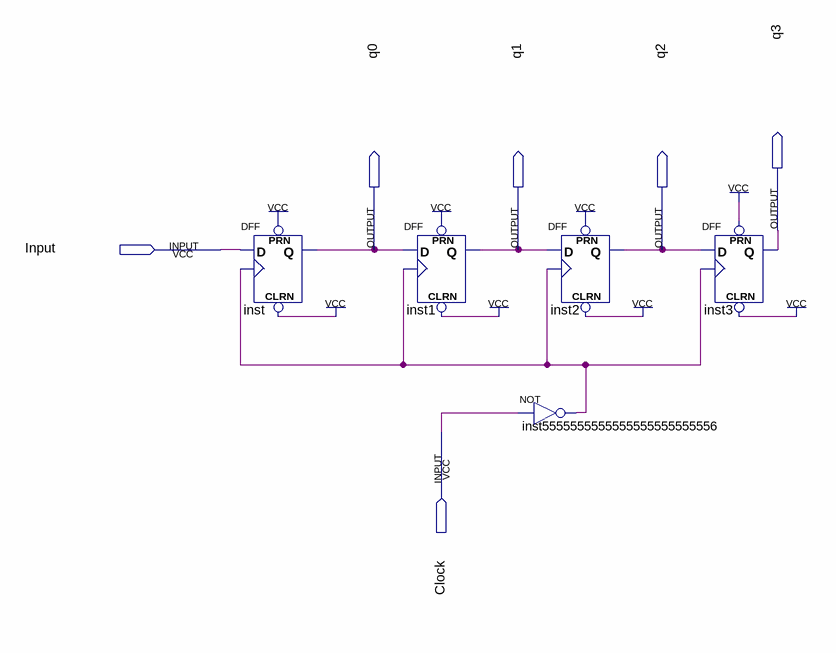
[diagram p0: schematic sheet]
// Quartus schematic lab10step1.bdf as structural Verilog: 5 symbols, 6 pins
module lab10step1 (
  input  Input,
  input  Clock,
  output q3,
  output q0,
  output q1,
  output q2
);

  wire inst5555555555555555555555556_out;

  DFF inst (.CLRN(1'b1), .CLK(inst5555555555555555555555556_out), .D(Input), .PRN(1'b1), .Q(q0));
  DFF inst1 (.CLRN(1'b1), .CLK(inst5555555555555555555555556_out), .D(q0), .PRN(1'b1), .Q(q1));
  DFF inst2 (.CLRN(1'b1), .CLK(inst5555555555555555555555556_out), .D(q1), .PRN(1'b1), .Q(q2));
  not inst5555555555555555555555556 (inst5555555555555555555555556_out, Clock);
  DFF inst3 (.CLRN(1'b1), .CLK(inst5555555555555555555555556_out), .D(q2), .PRN(1'b1), .Q(q3));
endmodule
